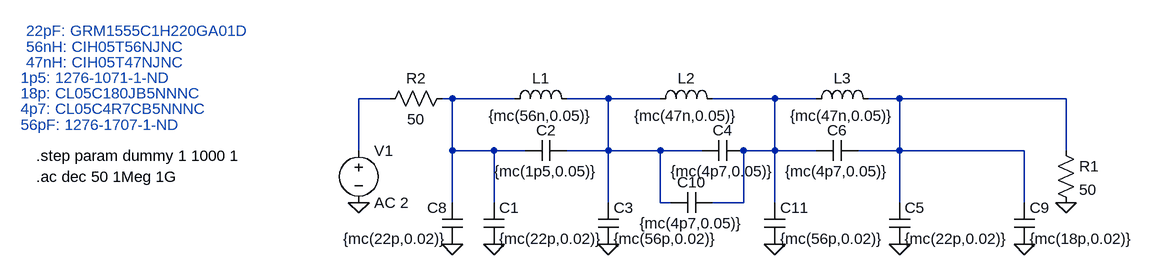
[diagram p0: schematic sim-filter-cauer.asc]
sim-filter-cauer.asc, the LTspice schematic file:
Version 4
SHEET 1 1124 680
WIRE -48 64 -96 64
WIRE 48 64 32 64
WIRE 144 64 48 64
WIRE 288 64 224 64
WIRE 368 64 288 64
WIRE 544 64 448 64
WIRE 608 64 544 64
WIRE 736 64 688 64
WIRE 992 64 736 64
WIRE -96 144 -96 64
WIRE 48 144 48 64
WIRE 112 144 48 144
WIRE 160 144 112 144
WIRE 288 144 288 64
WIRE 288 144 224 144
WIRE 368 144 288 144
WIRE 432 144 368 144
WIRE 544 144 544 64
WIRE 544 144 496 144
WIRE 608 144 544 144
WIRE 736 144 736 64
WIRE 736 144 672 144
WIRE 928 144 736 144
WIRE 992 144 992 64
WIRE 48 224 48 144
WIRE 112 224 112 144
WIRE 288 224 288 144
WIRE 368 224 368 144
WIRE 384 224 368 224
WIRE 496 224 496 144
WIRE 496 224 448 224
WIRE 544 224 544 144
WIRE 736 224 736 144
WIRE 928 224 928 144
FLAG 992 224 0
FLAG 736 288 0
FLAG 544 288 0
FLAG 288 288 0
FLAG 48 288 0
FLAG -96 224 0
FLAG 112 288 0
FLAG 928 288 0
SYMBOL cap 224 128 R90
WINDOW 0 0 32 VBottom 2
WINDOW 3 32 32 VTop 2
SYMATTR InstName C2
SYMATTR Value {mc(1p5,0.05)}
SYMATTR SpiceLine Rser=1 Lser=676p
SYMBOL ind 128 80 R270
WINDOW 0 32 56 VTop 2
WINDOW 3 5 56 VBottom 2
SYMATTR InstName L1
SYMATTR Value {mc(56n,0.05)}
SYMATTR SpiceLine Rser=1.4 Cpar=800f
SYMBOL cap 272 224 R0
SYMATTR InstName C3
SYMATTR Value {mc(56p,0.02)}
SYMATTR SpiceLine Rser=0.27 Lser=314p
SYMBOL ind 352 80 R270
WINDOW 0 32 56 VTop 2
WINDOW 3 5 56 VBottom 2
SYMATTR InstName L2
SYMATTR Value {mc(47n,0.05)}
SYMATTR SpiceLine Rser=1.3 Cpar=540f
SYMBOL cap 672 128 R90
WINDOW 0 0 32 VBottom 2
WINDOW 3 32 32 VTop 2
SYMATTR InstName C6
SYMATTR Value {mc(4p7,0.05)}
SYMATTR SpiceLine Rser=0.4 Lser=215p
SYMBOL res 976 128 R0
SYMATTR InstName R1
SYMATTR Value 50
SYMBOL res 48 48 R90
WINDOW 0 0 56 VBottom 2
WINDOW 3 32 56 VTop 2
SYMATTR InstName R2
SYMATTR Value 50
SYMBOL voltage -96 128 R0
SYMATTR InstName V1
SYMATTR Value AC 2
SYMBOL cap 64 224 M0
SYMATTR InstName C8
SYMATTR Value {mc(22p,0.02)}
SYMATTR SpiceLine Rser=0.3 Lser=512p
SYMBOL cap 96 224 R0
SYMATTR InstName C1
SYMATTR Value {mc(22p,0.02)}
SYMATTR SpiceLine Rser=0.3 Lser=512p
SYMBOL ind 592 80 R270
WINDOW 0 32 56 VTop 2
WINDOW 3 5 56 VBottom 2
SYMATTR InstName L3
SYMATTR Value {mc(47n,0.05)}
SYMATTR SpiceLine Rser=1.3 Cpar=540f
SYMBOL cap 912 224 R0
SYMATTR InstName C9
SYMATTR Value {mc(18p,0.02)}
SYMATTR SpiceLine Rser=0.3 Lser=352p
SYMBOL cap 496 128 R90
WINDOW 0 0 32 VBottom 2
WINDOW 3 32 32 VTop 2
SYMATTR InstName C4
SYMATTR Value {mc(4p7,0.05)}
SYMATTR SpiceLine Rser=0.4 Lser=215p
SYMBOL cap 448 208 R90
WINDOW 0 0 32 VBottom 2
WINDOW 3 32 32 VTop 2
SYMATTR InstName C10
SYMATTR Value {mc(4p7,0.05)}
SYMATTR SpiceLine Rser=0.4 Lser=215p
SYMBOL cap 528 224 R0
SYMATTR InstName C11
SYMATTR Value {mc(56p,0.02)}
SYMATTR SpiceLine Rser=0.27 Lser=314p
SYMBOL cap 720 224 R0
SYMATTR InstName C5
SYMATTR Value {mc(22p,0.02)}
SYMATTR SpiceLine Rser=0.3 Lser=512p
TEXT -592 184 Left 2 !.ac dec 50 1Meg 1G
TEXT -608 -40 Left 2 ;22pF: GRM1555C1H220GA01D
TEXT -608 -16 Left 2 ;56nH: CIH05T56NJNC
TEXT -608 8 Left 2 ;47nH: CIH05T47NJNC
TEXT -616 32 Left 2 ;1p5: 1276-1071-1-ND
TEXT -616 56 Left 2 ;18p: CL05C180JB5NNNC
TEXT -616 80 Left 2 ;4p7: CL05C4R7CB5NNNC
TEXT -616 104 Left 2 ;56pF: 1276-1707-1-ND
TEXT -592 152 Left 2 !.step param dummy 1 1000 1

The netlist it stands for:
* sim-filter-cauer.asc
C2 N003 N002 {mc(1p5,0.05)} Rser=1 Lser=676p
L1 N002 N003 {mc(56n,0.05)} Rser=1.4 Cpar=800f
C3 N003 0 {mc(56p,0.02)} Rser=0.27 Lser=314p
L2 N003 N004 {mc(47n,0.05)} Rser=1.3 Cpar=540f
C6 N005 N004 {mc(4p7,0.05)} Rser=0.4 Lser=215p
R1 N005 0 50
R2 N002 N001 50
V1 N001 0 AC 2
C8 N002 0 {mc(22p,0.02)} Rser=0.3 Lser=512p
C1 N002 0 {mc(22p,0.02)} Rser=0.3 Lser=512p
L3 N004 N005 {mc(47n,0.05)} Rser=1.3 Cpar=540f
C9 N005 0 {mc(18p,0.02)} Rser=0.3 Lser=352p
C4 N004 N003 {mc(4p7,0.05)} Rser=0.4 Lser=215p
C10 N004 N003 {mc(4p7,0.05)} Rser=0.4 Lser=215p
C11 N004 0 {mc(56p,0.02)} Rser=0.27 Lser=314p
C5 N005 0 {mc(22p,0.02)} Rser=0.3 Lser=512p
.ac dec 50 1Meg 1G
* 22pF: GRM1555C1H220GA01D
* 56nH: CIH05T56NJNC
* 47nH: CIH05T47NJNC
* 1p5: 1276-1071-1-ND
* 18p: CL05C180JB5NNNC
* 4p7: CL05C4R7CB5NNNC
* 56pF: 1276-1707-1-ND
.step param dummy 1 1000 1
.backanno
.end